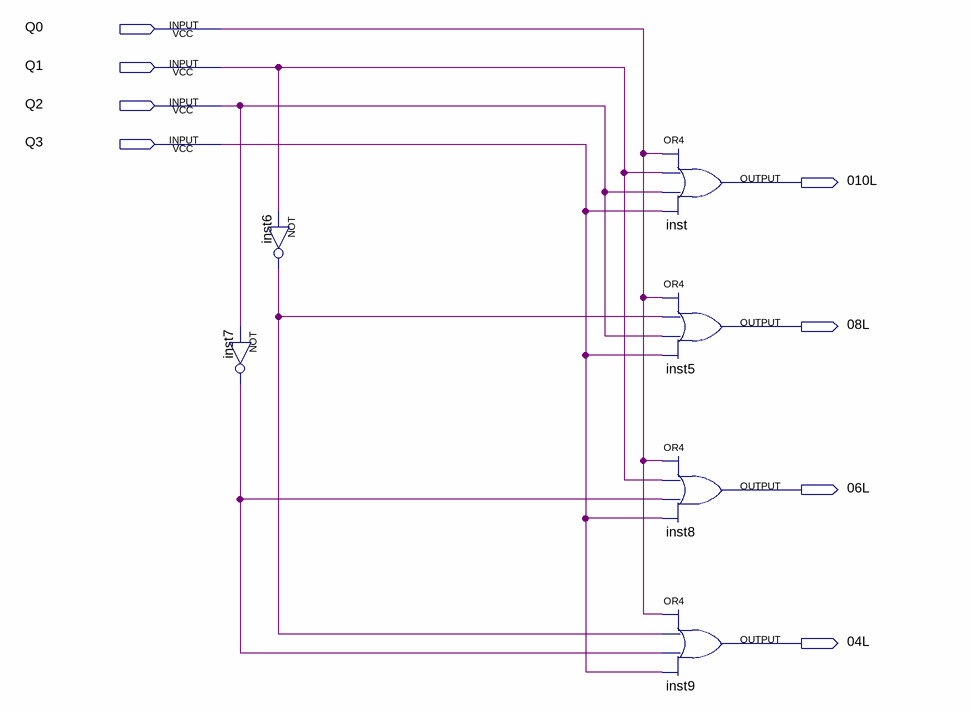
[diagram p0: schematic sheet]
// Quartus schematic LucesVerdes.bdf as structural Verilog: 6 symbols, 8 pins
module LucesVerdes (
  input  Q0,
  input  Q1,
  input  Q2,
  input  Q3,
  output \010L ,
  output \08L ,
  output \06L ,
  output \04L 
);

  wire inst6_out, inst7_out;

  not inst7 (inst7_out, Q2);
  not inst6 (inst6_out, Q1);
  or inst (\010L , Q0, Q1, Q2, Q3);
  or inst5 (\08L , Q0, inst6_out, Q2, Q3);
  or inst8 (\06L , Q0, Q1, inst7_out, Q3);
  or inst9 (\04L , Q0, inst6_out, inst7_out, Q3);
endmodule
